# Altium schematic sheet DS2480B-DONGLE.SchDoc
size A
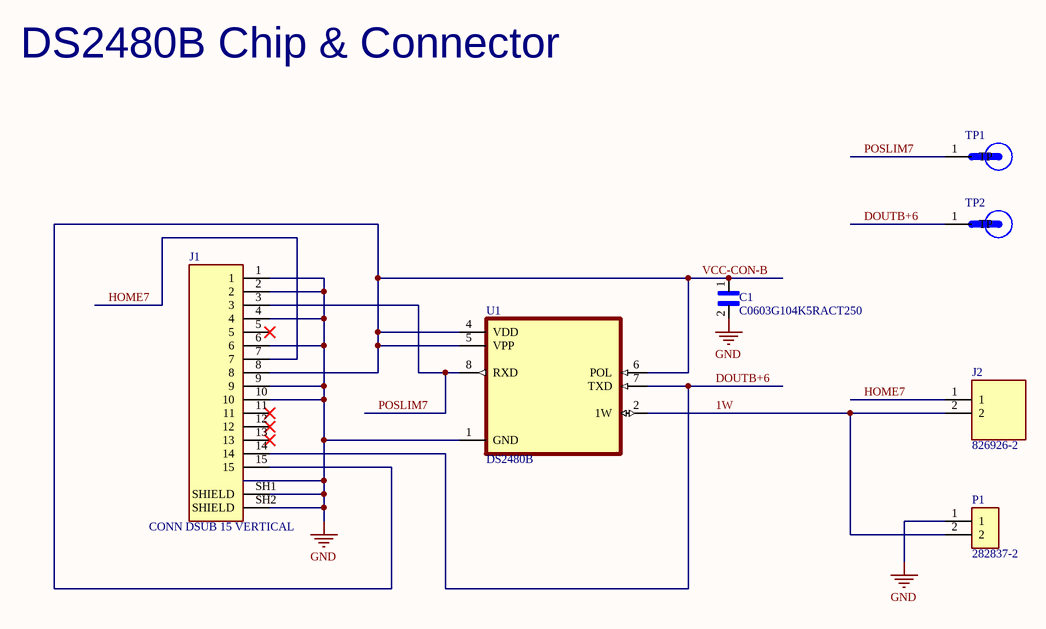
[diagram p0: DS2480B-DONGLE.SchDoc]

## Parts
C1  C0603G104K5RACT250  [CAPC1608X90]
J1  CONN DSUB 15 VERTICAL  [CONN_1734530-3]
J2  826926-2  [TE_826926-2]
P1  282837-2  [TE_282837-2]
TP1  (no value)  [TP380X203]
TP2  (no value)  [TP380X203]
U1  DS2480B  [SOIC127P600X175-8N]

## Nets
GND: C1.2 J1.1 J1.2 J1.4 J1.6 J1.9 J1.10 J1.SH1(SHIELD) J1.SH2(SHIELD) P1.1 U1.1(GND)
1W: J2.2 P1.2 U1.2(1W)
DOUTB+6: J1.14 TP2.1(TP) U1.7(TXD)
HOME7: J1.7 J2.1
POSLIM7: J1.3 TP1.1(TP) U1.8(RXD)
VCC-CON-B: C1.1 J1.8 J1.15 U1.4(VDD) U1.5(VPP) U1.6(POL)

Not connected (* = marked no-connect by the designer): J1 5* 11* 12* 13*

## Notes on the sheet
- DS2480B Chip & Connector

## Library data of the parts
C1 = C0603G104K5RACT250: Multilayer Ceramic Capacitors MLCC - SMD/SMT 50V 0.1uF 0603 X7R 0.1; MF: Kemet; Value: *; Price: None; MP: C0603G104K5RACT250; Package: 0603 Kemet
J1 = 1734530-3: 15 Position D-Sub, High Density Receptacle, Female Sockets Connector; Centerline_Pitch: 2.29 mm[.09 in]; Number_of_Positions: 15; MF: TE Connectivity; TE_purchase_URL: https://www.te.com/usa-en/product-1734530-3.html?te_bu=Cor&te_type=disp&te_campaign=seda_glo_cor-seda-global-disp-prtnr-fy19-seda-model-bom-cta_sma-317_1&elqCampaignId=32493; Availability: Unavailable; SnapEDA_Link: https://www.snapeda.com/parts/1734530-3/TE%20Connectivity%20AMP%20Connectors/view-part/239021/?ref=snap; MP: 1734530-3; Value: *; Price: None; Package: None; Product_Type: Connector
J2 = 826926-2: Pin header; pin strips; AMPMODU MOD II; male; PIN: 2; straight; Product_Type: Connector; Centerline_Pitch: 2.54 mm[.1 in]; MF: TE Connectivity; Number_of_Positions: 2; Availability: Unavailable; MP: 826926-2; Value: *; Package: None; EU_RoHS_Compliance: Compliant; Price: None
P1 = 282837-2: Connector Terminal Blocks Receptacle 2 Position 5.08mm Solder Straight Thru-Hole 13.5A/Contact; MF: TE Connectivity; Price: None; Check_prices: https://www.snapeda.com/parts/282837-2/TE%20Connectivity%20AMP%20Connectors/view-part/2549980/?ref=eda; Package: None; Purchase-URL: https://pricing.snapeda.com/search/part/282837-2/?ref=eda; SnapEDA_Link: https://www.snapeda.com/parts/282837-2/TE%20Connectivity%20AMP%20Connectors/view-part/2549980/?ref=snap; Value: *; MP: 282837-2; Availability: Good
TP1 TP2 = 5019: PC Test Point, Miniature Phosphor Bronze, Silver Plating Surface Mount Mounting Type; MF: Keystone Electronics; Value: *; MP: 5019; Package: 2010 Keystone; SnapEDA_Link: https://www.snapeda.com/parts/5019/Keystone%20Electronics/view-part/449144/?ref=snap; Digi-Key_Part_Number: 36-5019CT-ND; Digi-Key_Purchase_URL: https://www.digikey.com/product-detail/en/keystone-electronics/5019/36-5019CT-ND/3907344?utm_source=snapeda&utm_medium=aggregator&utm_campaign=symbol
U1 = DS2480B: 1/0 Driver RS232 8-SOIC; MF: Maxim Integrated; MP: DS2480B; Value: *; Package: SOIC-8 Maxim Integrated